# EAGLE schematic Lab3 (EAGLE 9.3.0)
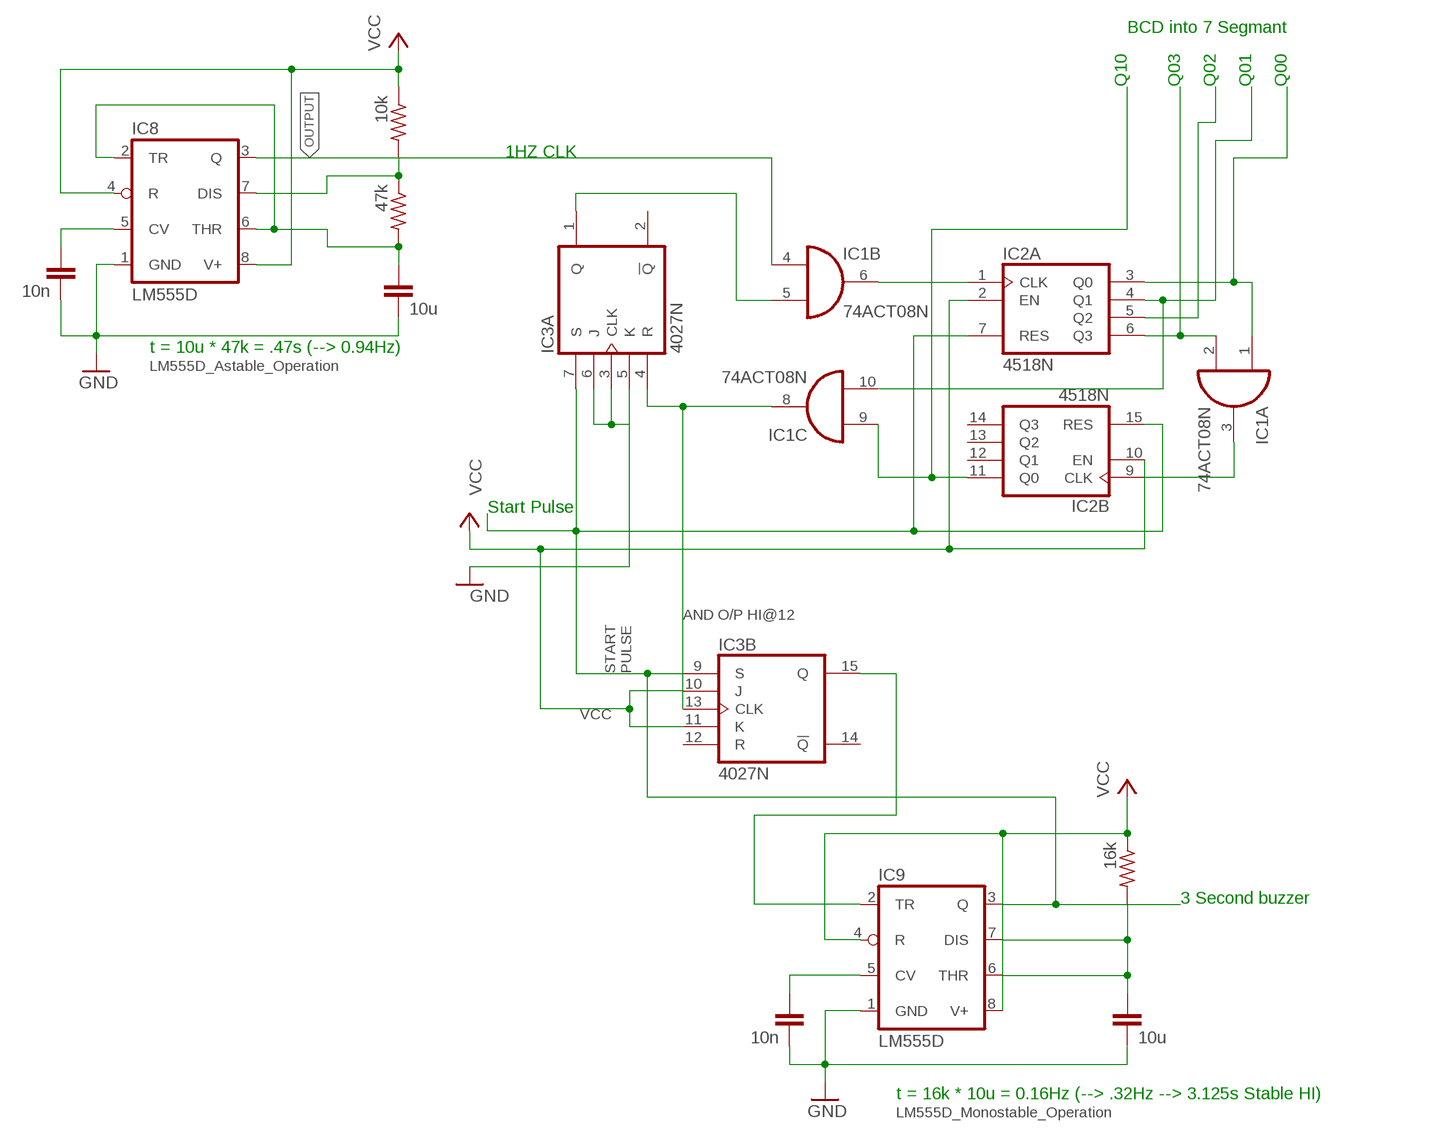
[diagram p0: schematic, sheet 1]

## Parts
C7  10u  C-EUC0805  [C0805]
C8  10n  C-EUC0805  [C0805]
C9  10u  C-EUC0805  [C0805]
C10  10n  C-EUC0805  [C0805]
IC1  74ACT08N  [DIL14]
IC2  4518N  [DIL16]
IC3  4027N  [DIL16]
IC8  LM555D  [SO08]
IC9  LM555D  [SO08]
RA3  10k  R-US_R0805  [R0805]
RA4  16k  R-US_R0805  [R0805]
RB1  47k  R-US_R0805  [R0805]

## Nets
GND: C7.2 C8.2 C9.2 C10.2 IC3.3(A:CLK) IC3.5(A:K) IC3.6(A:J) IC8.1(GND) IC9.1(GND)
N$1: IC1.1(A:I0) IC2.3(A:Q0)
N$2: IC1.2(A:I1) IC2.6(A:Q3)
N$3: IC1.3(A:O) IC2.9(B:CLK)
N$4: IC1.10(C:I1) IC2.4(A:Q1)
N$5: IC1.9(C:I0) IC2.11(B:Q0)
N$6: IC3.15(B:Q) IC9.2(TR)
N$7: IC1.5(B:I1) IC3.1(A:Q)
N$8: IC1.6(B:O) IC2.1(A:CLK)
N$9: IC2.5(A:Q2)
N$10: IC2.2(A:EN) IC2.10(B:EN) IC3.10(B:J) IC3.11(B:K) ; supply symbol labelled VCC
N$11: C9.1 IC9.6(THR) IC9.7(DIS) RA4.2
N$12: IC2.7(A:RES) IC2.15(B:RES) IC3.7(A:S) IC3.9(B:S) IC9.3(Q)
N$21: C8.1 IC8.5(CV)
N$22: IC8.7(DIS) RA3.2 RB1.1
N$23: C7.1 IC8.2(TR) IC8.6(THR) RB1.2
N$24: C10.1 IC9.5(CV)
OUTPUT: IC1.4(B:I0) IC1.8(C:O) IC3.4(A:R) IC3.13(B:CLK) IC8.3(Q)
VCC: IC8.4(R) IC8.8(V+) IC9.4(R) IC9.8(V+) RA3.1 RA4.1
Unconnected: IC1.11(D:O) IC1.12(D:I0) IC1.13(D:I1) IC2.12(B:Q1) IC2.13(B:Q2) IC2.14(B:Q3) IC3.2(A:!Q) IC3.12(B:R) IC3.14(B:!Q)

## Notes on the sheet
- BCD into 7 Segmant
- Q10 | Q03 | Q02 | Q01 | Q00
- 1HZ CLK
- t = 10u * 47k = .47s (--> 0.94Hz)
- LM555D_Astable_Operation
- Start Pulse
- AND O/P HI@12
- START
  PULSE
- VCC
- 3 Second buzzer
- t = 16k * 10u = 0.16Hz (--> .32Hz --> 3.125s Stable HI)
- LM555D_Monostable_Operation

## Power pins joined to a net without a drawn wire
GND: IC1.7(P:GND)
VCC: IC1.14(P:VCC)
VDD: IC2.16(P:VDD) IC3.16(P:VDD)
VSS: IC2.8(P:VSS) IC3.8(P:VSS)

## Library data of the parts
C7-C10 = rcl:C-EU: CAPACITOR, European symbol
IC1 = 74xx-eu:74*08: Quad 2-input AND gate
IC2 = 45xx:4518: Dual BCD up COUNTER
IC3 = 40xx:4027: Dual JK FLIP FLOP
IC8 IC9 = linear:*555: TIMER
RA3 RA4 RB1 = rcl:R-US_: RESISTOR, American symbol